# EAGLE design rgb-led-cc-driver-mk-1.0 (EAGLE 6.5.0)
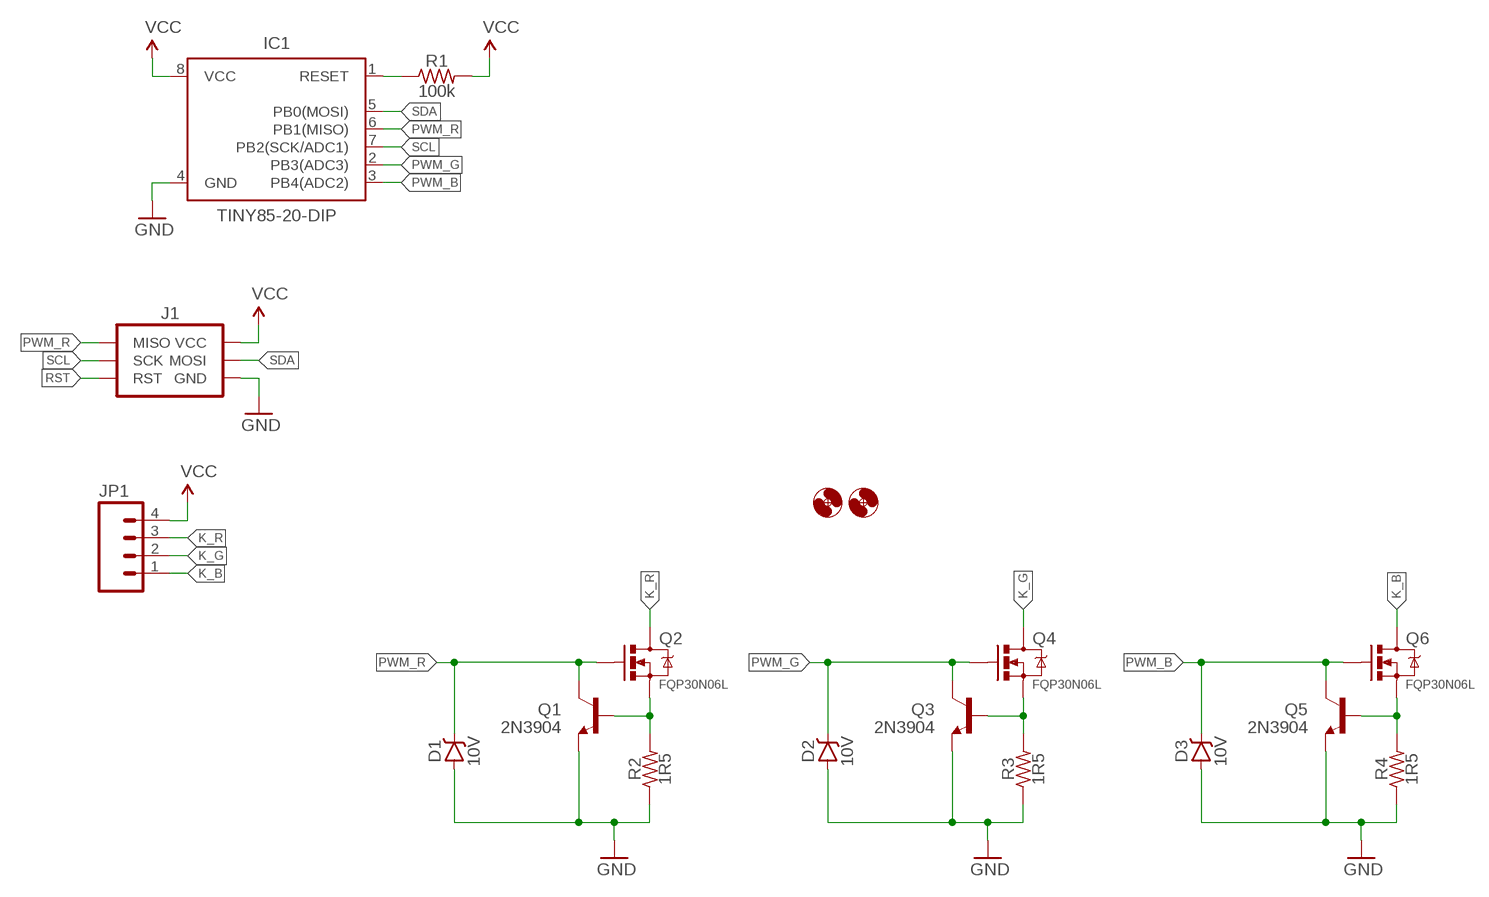
[diagram p0: schematic, sheet 1]

## Parts
D1  10V  DIODE-ZENER10.16MM-PTH  [DIODE-ZENNER-10.16MM]
D2  10V  DIODE-ZENER10.16MM-PTH  [DIODE-ZENNER-10.16MM]
D3  10V  DIODE-ZENER10.16MM-PTH  [DIODE-ZENNER-10.16MM]
H1  HOLE#2  [HOLE-#2]
H2  HOLE#2  [HOLE-#2]
IC1  TINY85-20-DIP  ATTINY45TINY85-20-DIP  [DIP08]
J1  AVR_SPI_PRG_6PTH_INLINE_I2C  [AVR_ISP_INLINE_PTH_I2C]
JP1  M04PTH  [1X04-PTH-VERT]
Q1  2N3904  TRANSISTOR_NPNTO-92-AMMO-EBC  [TO-92-AMMO]
Q2  FQP30N06L  MOSFET-NCHANNELTO-220  [TO220-THERMPAD]
Q3  2N3904  TRANSISTOR_NPNTO-92-AMMO-EBC  [TO-92-AMMO]
Q4  FQP30N06L  MOSFET-NCHANNELTO-220  [TO220-THERMPAD]
Q5  2N3904  TRANSISTOR_NPNTO-92-AMMO-EBC  [TO-92-AMMO]
Q6  FQP30N06L  MOSFET-NCHANNELTO-220  [TO220-THERMPAD]
R1  100k  RESISTORPTH-AXIAL-10.16MM  [RESISTOR-AXIAL-PTH-10.16MM]
R2  1R5  RESISTORPTH-AXIAL-10.16MM  [RESISTOR-AXIAL-PTH-10.16MM]
R3  1R5  RESISTORPTH-AXIAL-10.16MM  [RESISTOR-AXIAL-PTH-10.16MM]
R4  1R5  RESISTORPTH-AXIAL-10.16MM  [RESISTOR-AXIAL-PTH-10.16MM]

## Nets
GND: D1.A D2.A D3.A IC1.4(GND) J1.GND Q1.1(E) Q3.1(E) Q5.1(E) R2.P$1 R3.P$1 R4.P$1
K_B: JP1.1 Q6.2@1(D) Q6.2@2(D)
K_G: JP1.2 Q4.2@1(D) Q4.2@2(D)
K_R: JP1.3 Q2.2@1(D) Q2.2@2(D)
N$1: Q1.2(B) Q2.3(S) R2.P$2
N$2: Q3.2(B) Q4.3(S) R3.P$2
N$3: Q5.2(B) Q6.3(S) R4.P$2
PWM_B: D3.K(C) IC1.3(PB4(ADC2)) Q5.3(C) Q6.1(G)
PWM_G: D2.K(C) IC1.2(PB3(ADC3)) Q3.3(C) Q4.1(G)
PWM_R: D1.K(C) IC1.6(PB1(MISO)) J1.MISO Q1.3(C) Q2.1(G)
RST: IC1.1(RESET) J1.RESET(RST) R1.P$1
SCL: IC1.7(PB2(SCK/ADC1)) J1.SCK
SDA: IC1.5(PB0(MOSI)) J1.MOSI
VCC: IC1.8(VCC) J1.VCC JP1.4 R1.P$2

## Library data of the parts
D1-D3 = A_butts:DIODE-ZENER: Zener Diode Production Part - 8199 3.4V Zener Voltage
H1 H2 = A_butts:HOLE: MOUNTING HOLE with drill center marker
IC1 = A_butts:ATTINY45: Atmel 8-pin 2/4/8kB flash uC; PROD_ID: IC-09445
J1 = A_butts:AVR_SPI_PRG_6: AVR ISP 6 Pin This is the reduced ISP connector for AVR programming. Common on Arduino. This footprint will take up less PCB space and can be used with a 10-pin to 6-pin adapter such as SKU: BOB-08508 **Special note about "TEST_POINT" package. The stop mask is on the top side, so if you want your programming test points to be on the bottom of your board, make sure to place this package on the bottom side of the board. This also ensure that the orientation to program from the bottom side will be correct.
JP1 = A_butts:M04: Header 4 Standard 4-pin 0.1" header. Use with straight break away headers (SKU : PRT-00116), right angle break away headers (PRT-00553), swiss pins (PRT-00743), machine pins (PRT-00117), and female headers (PRT-00115). Molex polarized connector foot print use with SKU : PRT-08231 with associated crimp pins and housings. 1MM SMD Version SKU: PRT-10208
Q1 Q3 Q5 = A_butts:TRANSISTOR_NPN: Generic NPN BJT MMBT2222A - TRANS-08049 (SOT-23, 1A 40V) MPSA42 - TRANS-09116 (SOT-23, 500mA 300V) MMBT5088LT1G - TRANS-11160 (SOT-23, 50 mA 30V) BC547 - COM-08928 <http://www.sparkfun.com/products/8928> (TO-92 45V 100mA) (1.Collector 2.Base 3.Emitter) 2N3904 - COM-00521 <http://www.sparkfun.com/products/521> (TO-92 40V 200mA) (1.Emitter 2.Base 3.Collector) P2N2222A - COM-12852 <http://www.sparkfun.com/products/12852> (TO-92 40V 600mA) (1.Collector 2.Base 3.Emitter)
Q2 Q4 Q6 = A_butts:MOSFET-NCHANNEL: Common NMOSFET Parts MFG P/N Store ID Prod ID FDD8780 TRANS-09984 SI7820DN TRANS-11055 FDS6630A IC-08089 2N7002PW TRANS-11151 FQP30N06L COM-10213 TRANS-10060 BSS123LT1G TRANS-08345 BSS138 TRANS-00830 BS170 2N7000
R1-R4 = A_butts:RESISTOR: RESISTOR, American symbol

## Board
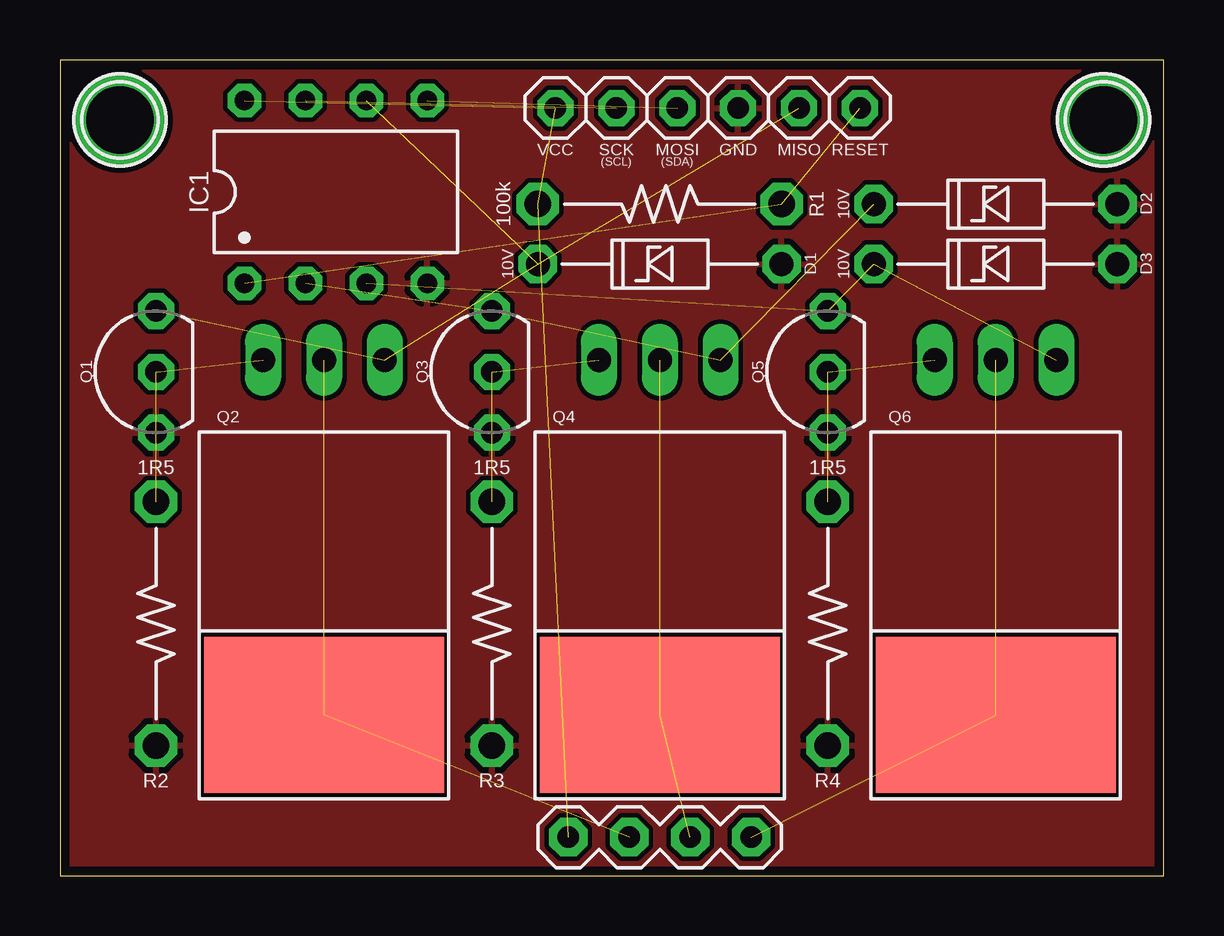
[diagram p1: board, top side]
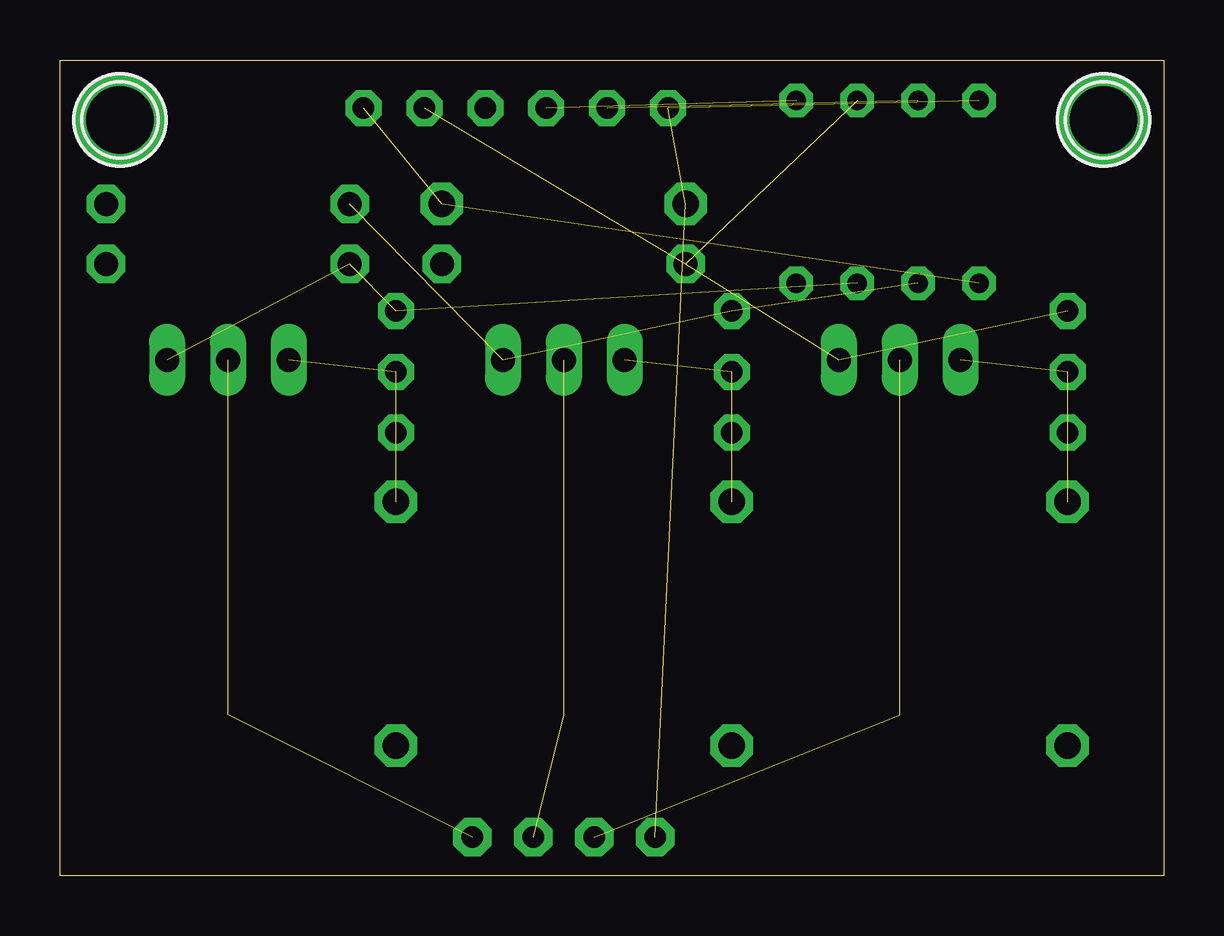
[diagram p2: board, bottom side, seen from below]

Size 46 x 34 mm. Coordinates in mm from the lower left corner, seen from the top.
Outline: 0,34 0,0 46,0 46,34 0,34
Copper layers (1*16): Top 0.0356mm / dielectric 1.5011mm / Bottom 0.0356mm
Design rules "LaenPCBOrder2": minimum track width 6mil, minimum drill 13mil, track to track 6mil, track to pad 6mil, pad to pad 6mil, via to via 6mil, smd to smd 6mil, copper to edge 15mil, drill to drill 6mil, minimum pad ring 7mil, minimum via ring 7mil, stop-mask expansion 3mil, vias tented up to drill 20mil, thermal gap 10mil

### Footprints (pad centres in the part's own frame; a part is rotated, then mirrored left to right if it is on the bottom)
DIODE-ZENNER-10.16MM = drill 1 pad 1.6 octagon: A -5.08,0; K 5.08,0
HOLE-#2 = drill 2.8 pad 3.81: P$1 0,0
DIP08 = drill 0.8 pad 1.4 octagon: 1 -3.81,-3.81; 2 -1.27,-3.81; 3 1.27,-3.81; 4 3.81,-3.81; 5 3.81,3.81; 6 1.27,3.81; 7 -1.27,3.81; 8 -3.81,3.81
AVR_ISP_INLINE_PTH_I2C = drill 0.9 pad 1.5 octagon: GND 1.27,0; MISO 3.81,0; MOSI -1.27,0; RESET 6.35,0; SCK -3.81,0; VCC -6.35,0
1X04-PTH-VERT = drill 0.9 pad 1.6 octagon: 1 0,0; 2 2.54,0; 3 5.08,0; 4 7.62,0
TO-92-AMMO = drill 0.9 pad 1.5 octagon: 1 -2.54,0; 2 0,0; 3 2.54,0
TO220-THERMPAD = drill 1 long: 1 -2.54,0; 2@2 0,0; 3 2.54,0 | smd 10 x 6.5: 2@1 0,14.81
RESISTOR-AXIAL-PTH-10.16MM = drill 1.1 pad 1.778 octagon: P$1 -5.08,0; P$2 5.08,0

### Placement (x,y rotation side)
D1  25,25.5 180 top
D2  39,28 180 top
D3  39,25.5 180 top
H1  43.5,31.5 0 top
H2  2.5,31.5 0 top
IC1  11.5,28.5 0 top
J1  27,32 0 top
JP1  28.81,1.6 180 top
Q1  4,21 90 top
Q2  11,21.5 180 top
Q3  18,21 90 top
Q4  25,21.5 180 top
Q5  32,21 90 top
Q6  39,21.5 180 top
R1  25,28 180 top
R2  4,10.5 90 top
R3  18,10.5 90 top
R4  32,10.5 90 top

### Tracks (layer width: path | path; a pad name or v marks a point on that pad's centre or on a via)
GND
  pour Top (isolate 0.2): 46,34 46,0 0,0 0,34
K_B  (2 unrouted)
K_G  (2 unrouted)
K_R  (2 unrouted)
N$1  (2 unrouted)
N$2  (2 unrouted)
N$3  (2 unrouted)
PWM_B  (3 unrouted)
PWM_G  (3 unrouted)
PWM_R  (4 unrouted)
RST  (2 unrouted)
SCL  (1 unrouted)
SDA  (1 unrouted)
VCC  (3 unrouted)